# Altium project ROV_main_board.PrjPcb
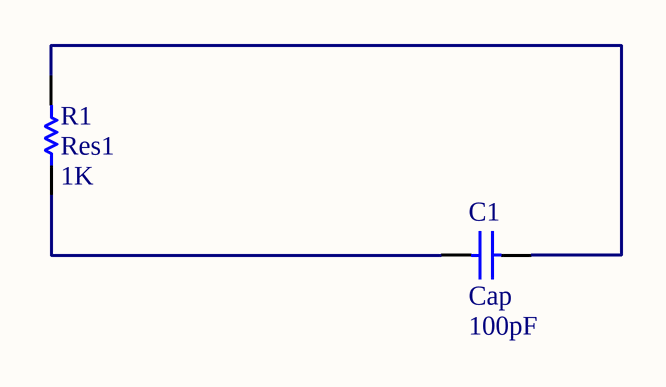
[diagram p0: ROV_main_board_sch.SchDoc]
1 sheet, 2 parts. Net scope: global (net labels, ports and power ports of the same name join across sheets).
Board file: ROV_main_board.PcbDoc

## Sheet ROV_main_board_sch.SchDoc
size A

### Parts
C1  Cap  value 100pF  [RAD-0.3]
R1  Res1  value 1K  [AXIAL-0.3]

### Nets
NetC1_1: C1.1 R1.1
NetC1_2: C1.2 R1.2

### Library data of the parts
C1 = Cap: Capacitor; Published: 8-Jun-2000; LatestRevisionDate: 17-Jul-2002; LatestRevisionNote: Re-released for DXP Platform.; PackageReference: RAD-0.3; Publisher: Altium Limited; PackageDescription: Radial Cap, Thru-Hole; 2 Leads; 0.3 in Pin Spacing
R1 = Res1: Resistor; Published: 8-Jun-2000; LatestRevisionDate: 17-Jul-2002; LatestRevisionNote: Re-released for DXP Platform.; PackageReference: AXIAL-0.3; Publisher: Altium Limited; PackageDescription: Axial Device, Thru-Hole; 2 Leads; 0.3 in Pin Spacing